# Altium schematic sheet BME680.SchDoc: BME680.SchDoc
size 558 x 431 mm; Date: 2/16/2022; Author: Xitong Zheng, Hongliang Chen; SheetNumber: 3; SheetTotal: 11
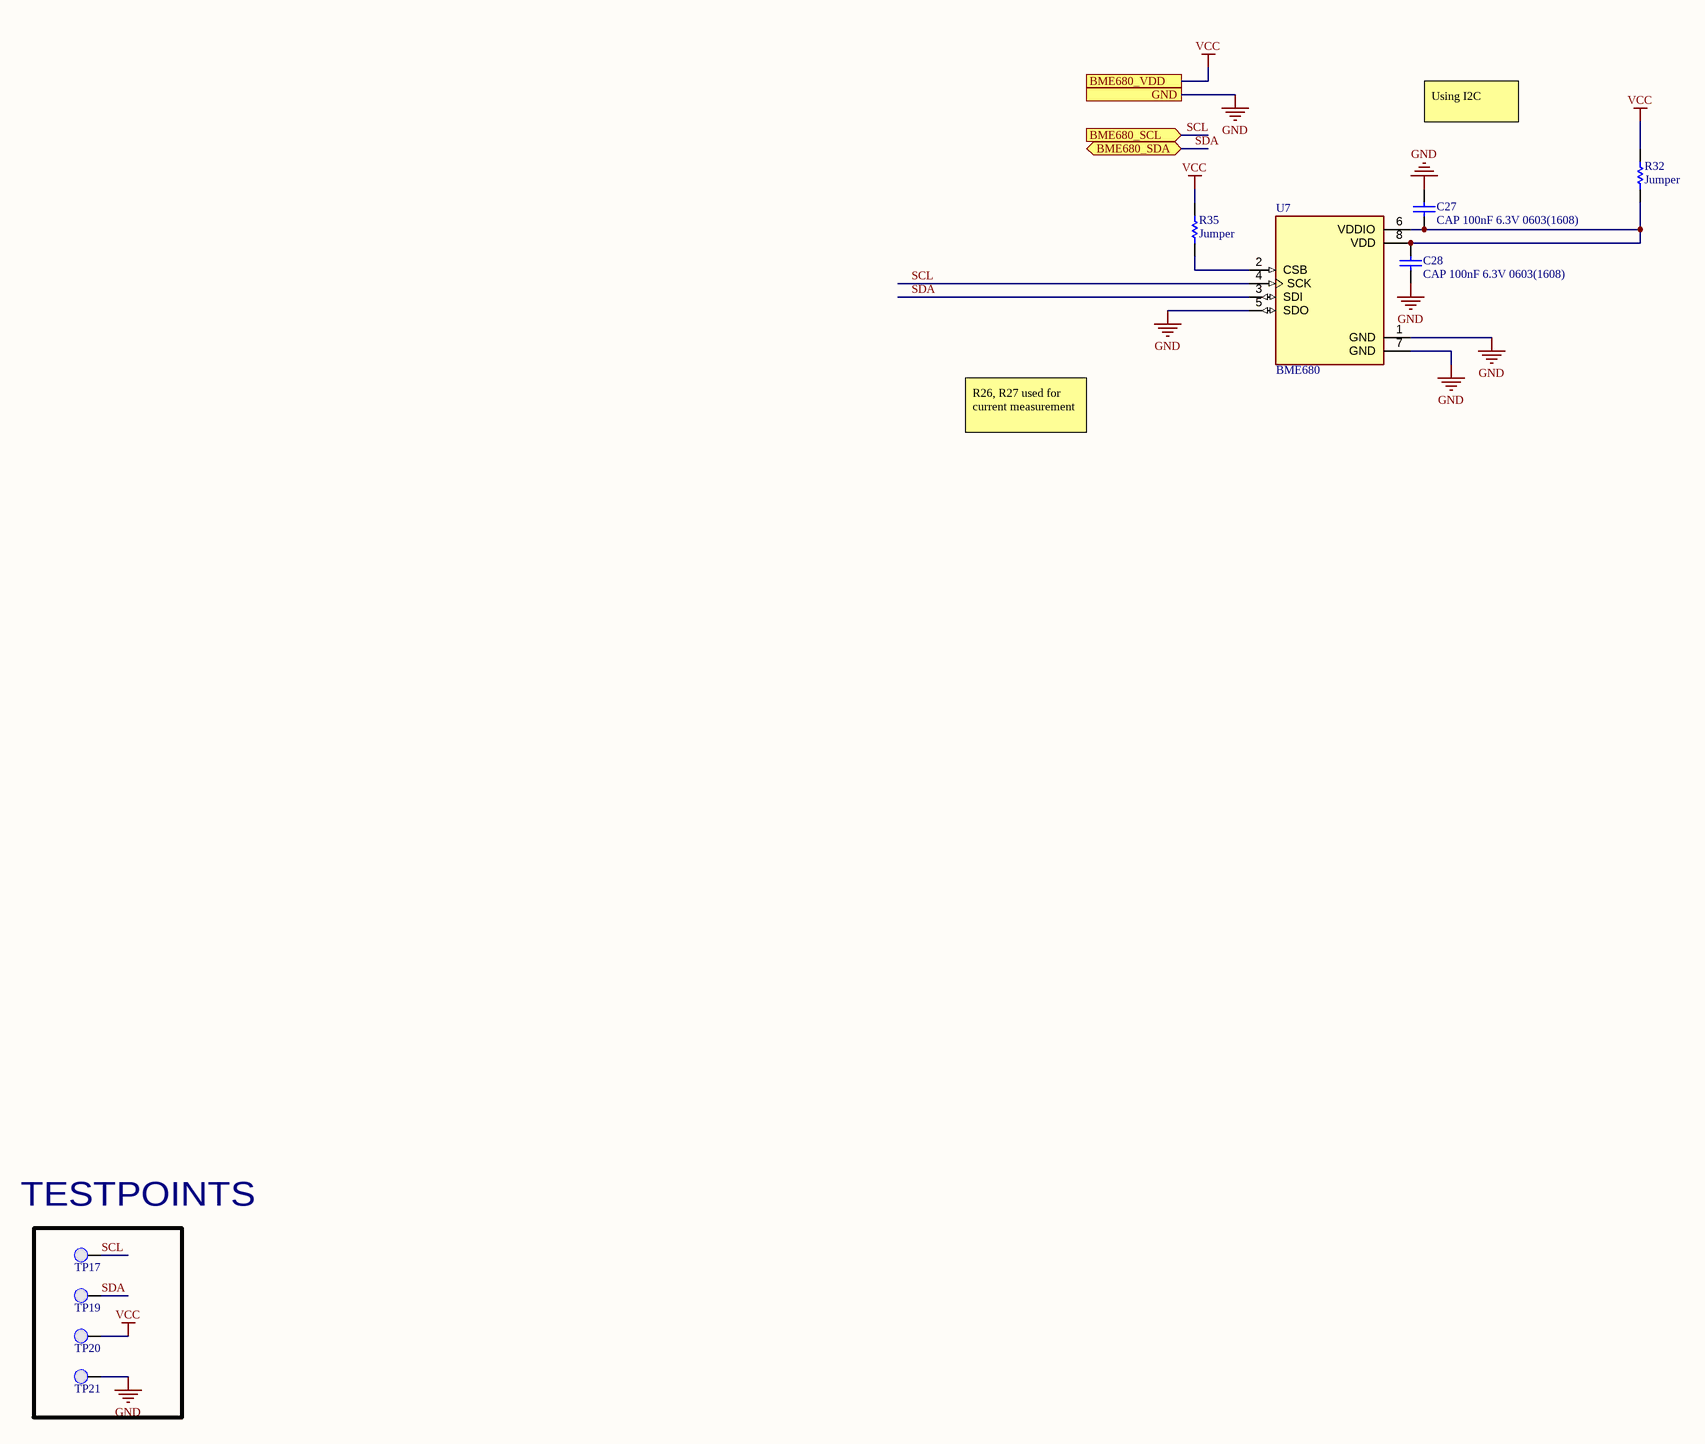
[diagram p0: BME680.SchDoc]

## Parts
C27  CAP 100nF 6.3V 0603(1608)  [CAPC0603(1608)100_M]
C28  CAP 100nF 6.3V 0603(1608)  [CAPC0603(1608)100_M]
R32  Jumper  [RESC0603(1608)_N]
R35  Jumper  [RESC0603(1608)_N]
TP17  0.1" Pad  [PCBComponent]  (value not drawn)
TP19  0.1" Pad  [PCBComponent]  (value not drawn)
TP20  0.1" Pad  [PCBComponent]  (value not drawn)
TP21  0.1" Pad  [PCBComponent]  (value not drawn)
U7  BME680  [PSON80P300X300X100-8N]

## Ports
BME680_SCL (in), BME680_SDA (bidir), BME680_VDD, GND

## Nets
GND: C27.1 C28.1 TP21.1(PAD) U7.1(GND) U7.5(SDO) U7.7(GND) ; port GND
VCC: R32.2 R35.2 TP20.1(PAD) ; port BME680_VDD
SCL: TP17.1(PAD) U7.4(SCK) ; port BME680_SCL
SDA: TP19.1(PAD) U7.3(SDI) ; port BME680_SDA
NetC27_2: C27.2 C28.2 R32.1 U7.6(VDDIO) U7.8(VDD)
NetR35_1: R35.1 U7.2(CSB)

## Notes on the sheet
- Using I2C
- R26, R27 used for current measurement
- (near TP17) TESTPOINTS
- DWG. NO.
- REV.
- SHT.
- REVISION
- DESCRIPTION
- DATE
- APPROVED
- THIS DOCUMENT AND THE DATA DISCLOSED HEREIN OR HEREWITH IS THE PROPERTY OF ALTIUM LIMITED AND MAY BE FREELY DISTRIBUTED IN WHOLE. NO RIGHTS ARE RESERVED OR EXPRESS OR IMPLIED WARANTEE GIVEN.
- ENG:
- DSN:
- APPROVALS
- PROJECT
- DOCUMENT REVISION:
- DESIGN ITEM:
- CHK:
- BOM:
- REFERENCE DOCUMENTS
- PROJECT REVISION:
- TITLE
- FAB DWG:
- PCB DWG:
- ASSY DWG:
- SCALE:
- SIZE
- C
- CAGE CODE
- FILE NAME
- DWG NO.
- SHEET
- OF
- REV

## Library data of the parts
C27 C28 = CMP-1035-02575-1: CAP 100nF 6.3V ±5% 0603 (1608 Metric) Thickness 1mm SMD; Tolerance: Â±5%; Case-Metric: 1608; Case-EIA: 0603; Technology: SMT; Rated Voltage: 6.3 V; Max Thickness: 1 mm; Value: 100nF
R32 R35 = CMP-1012-00001-1: Jumper 0603 (1608 Metric); Case-Metric: 1608; Value: 0.00 Ohm; Power: None; Case-EIA: 0603; Technology: SMT; Tolerance: None
TP17 TP19-TP21 = 0.1" Pad-A.4
U7 = BME680: Integrated Environmental Unit; MF: {'manufacturer': u'Bosch Sensortec'}; Value: *; Package: None; Availability: Unavailable; MP: BME680; Price: None